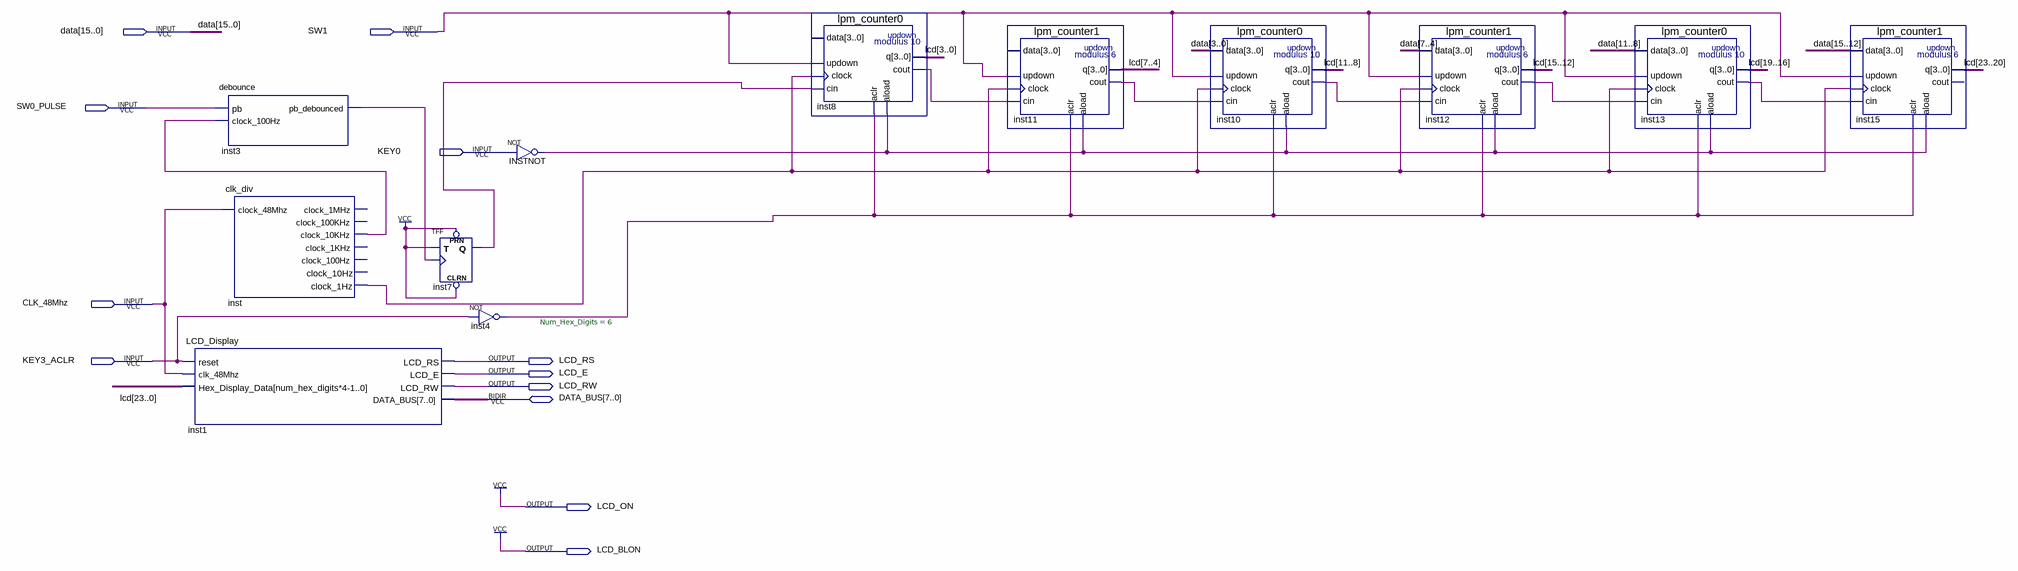
[diagram p0: schematic sheet]
// Quartus schematic tutor3.bdf as structural Verilog: 12 symbols, 12 pins
module tutor3 (
  input  [15:0] data,
  input  SW1,
  input  SW0_PULSE,
  input  KEY0,
  input  CLK_48Mhz,
  input  KEY3_ACLR,
  inout  [7:0] DATA_BUS,
  output LCD_RS,
  output LCD_E,
  output LCD_RW,
  output LCD_ON,
  output LCD_BLON
);

  wire inst3_pb_debounced, inst4_out, inst7_q, inst8_cout, inst10_cout, inst11_cout, inst12_cout,
       inst13_cout, inst_clock_1hz, inst_clock_10khz, INSTNOT_out;
  wire [23:0] lcd;

  debounce inst3 (.pb(SW0_PULSE), .clock_100Hz(inst_clock_10khz), .pb_debounced(inst3_pb_debounced));
  clk_div inst (
    .clock_48Mhz(CLK_48Mhz), .clock_10KHz(inst_clock_10khz), .clock_1Hz(inst_clock_1hz));  // open: clock_1MHz, clock_100KHz, clock_1KHz, clock_100Hz, clock_10Hz
  LCD_Display #(.Num_Hex_Digits(6)) inst1 (
    .reset(KEY3_ACLR), .clk_48Mhz(CLK_48Mhz), .Hex_Display_Data(lcd), .LCD_RS(LCD_RS), .LCD_E(LCD_E),
    .LCD_RW(LCD_RW), .DATA_BUS(DATA_BUS));
  TFF inst7 (.PRN(1'b1), .CLRN(1'b1), .T(1'b1), .CLK(inst3_pb_debounced), .Q(inst7_q));
  not inst4 (inst4_out, KEY3_ACLR);
  not INSTNOT (INSTNOT_out, KEY0);
  lpm_counter0 inst8 (
    .updown(SW1), .clock(inst_clock_1hz), .cin(inst7_q), .aclr(inst4_out), .aload(INSTNOT_out),
    .cout(inst8_cout), .q(lcd[3:0]));  // open: data
  lpm_counter1 inst11 (
    .updown(SW1), .clock(inst_clock_1hz), .cin(inst8_cout), .aclr(inst4_out), .aload(INSTNOT_out),
    .cout(inst11_cout), .q(lcd[7:4]));  // open: data
  lpm_counter0 inst10 (
    .data(data[3:0]), .updown(SW1), .clock(inst_clock_1hz), .cin(inst11_cout), .aclr(inst4_out),
    .aload(INSTNOT_out), .cout(inst10_cout), .q(lcd[11:8]));
  lpm_counter1 inst12 (
    .data(data[7:4]), .updown(SW1), .clock(inst_clock_1hz), .cin(inst10_cout), .aclr(inst4_out),
    .aload(INSTNOT_out), .cout(inst12_cout), .q(lcd[15:12]));
  lpm_counter0 inst13 (
    .data(data[11:8]), .updown(SW1), .clock(inst_clock_1hz), .cin(inst12_cout), .aclr(inst4_out),
    .aload(INSTNOT_out), .cout(inst13_cout), .q(lcd[19:16]));
  lpm_counter1 inst15 (
    .data(data[15:12]), .updown(SW1), .clock(inst_clock_1hz), .cin(inst13_cout), .aclr(inst4_out),
    .aload(INSTNOT_out), .q(lcd[23:20]));  // open: cout

  assign LCD_BLON = 1'b1;
  assign LCD_ON = 1'b1;
endmodule
